# Altium schematic sheet SCH13_RS232.SchDoc: Beaglebone Black - RS232
size B; Organization: CWRUbotix; Address1: 10900 Euclid Avenue; Address2: Cleveland, OH 44106; Address3: USA; Revision: 1.0; SheetNumber: 13; SheetTotal: 13
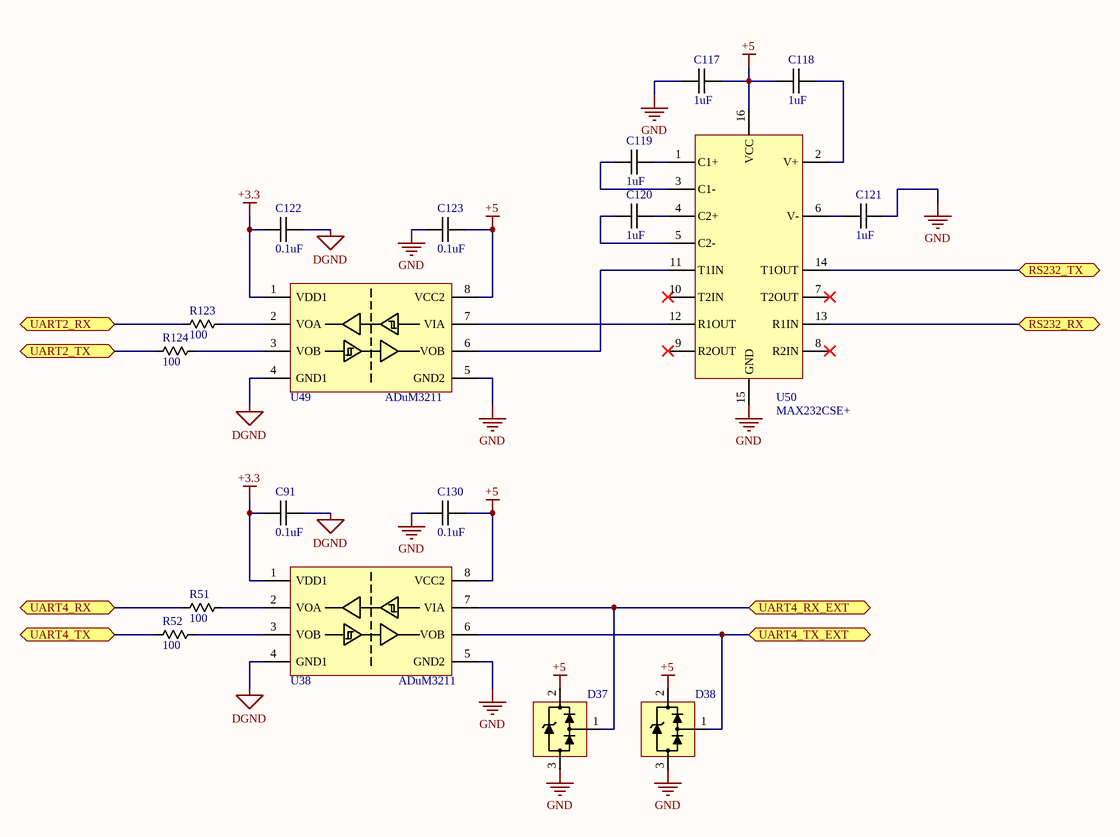
[diagram p0: SCH13_RS232.SchDoc]

## Parts
C91  0.1uF  [chip_0603]
C117  1uF  [chip_0805]
C118  1uF  [chip_0805]
C119  1uF  [chip_0805]
C120  1uF  [chip_0805]
C121  1uF  [chip_0805]
C122  0.1uF  [chip_0603]
C123  0.1uF  [chip_0603]
C130  0.1uF  [chip_0603]
D37  DLPT05  [sot-23-3]  (value not drawn)
D38  DLPT05  [sot-23-3]  (value not drawn)
R51  100  [chip_0603]
R52  100  [chip_0603]
R123  100  [chip_0603]
R124  100  [chip_0603]
U38  ADuM3211  [SO-8]
U49  ADuM3211  [SO-8]
U50  MAX232CSE+  [SO-16]

## Ports
RS232_RX (bidir), RS232_TX (bidir), UART2_RX (bidir), UART2_TX (bidir), UART4_RX (bidir), UART4_RX_EXT (bidir), UART4_TX (bidir), UART4_TX_EXT (bidir)

## Nets
+3.3: C91.2 C122.2 U38.1(VDD1) U49.1(VDD1)
+5: C117.2 C118.1 C123.1 C130.1 D37.2(VCC) D38.2(VCC) U38.8(VCC2) U49.8(VCC2) U50.16(VCC)
DGND: C91.1 C122.1 U38.4(GND1) U49.4(GND1)
GND: C117.1 C121.2 C123.2 C130.2 D37.3(GND) D38.3(GND) U38.5(GND2) U49.5(GND2) U50.15(GND)
RS232_RX: U50.13(R1IN) ; port RS232_RX
RS232_TX: U50.14(T1OUT) ; port RS232_TX
UART2_RX: R123.1 ; port UART2_RX
UART2_TX: R124.1 ; port UART2_TX
UART4_RX: R51.1 ; port UART4_RX
UART4_RX_EXT: D37.1(LINE) U38.7(VIA) ; port UART4_RX_EXT
UART4_TX: R52.1 ; port UART4_TX
UART4_TX_EXT: D38.1(LINE) U38.6(VOB) ; port UART4_TX_EXT
NetC118_2: C118.2 U50.2(V+)
NetC119_1: C119.1 U50.3(C1-)
NetC119_2: C119.2 U50.1(C1+)
NetC120_1: C120.1 U50.5(C2-)
NetC120_2: C120.2 U50.4(C2+)
NetC121_1: C121.1 U50.6(V-)
NetR51_2: R51.2 U38.2(VOA)
NetR52_2: R52.2 U38.3(VOB)
NetR123_2: R123.2 U49.2(VOA)
NetR124_2: R124.2 U49.3(VOB)
NetU49_6: U49.6(VOB) U50.11(T1IN)
NetU49_7: U49.7(VIA) U50.12(R1OUT)

Not connected (* = marked no-connect by the designer): U50 7(T2OUT)* 8(R2IN)* 9(R2OUT)* 10(T2IN)*

## Notes on the sheet
- Title
- Size:
- B
- Number:
- Revision:
- Date:
- Sheet
- of

## Library data of the parts
C91 C122 C123 C130 = CAP-00542: CAP, 0.1uF, ±10%, 16V, X7R, 0603; Manufacturer: Murata; Part Number: CAP-00542; Capacitance: 0.1uF; Tolerance: ±10%; Voltage Rating: 16V; Type: X7R
C117-C121 = CAP-00110: CAP, 1uF, 10%, 16V, X7R, 0805; Manufacturer: Murata; Manufacturer PN: GRM21BR71C105KA01K; Part Number: CAP-00110; Capacitance: 1uF; Tolerance: 10%; Voltage Rating: 16V; Type: X7R
D37 D38 = DIO-00057: TVS, Steering (Rail-Rail), 9.8V Clamping, 17A Peak Pulse, SOT-23; Manufacturer: Diodes Incorporated; Manufacturer PN: DLPT05-7-F; Reverse Breakdown Voltage: 6.0V; Part Number: DIO-00057; Type: TVS; Cost: 0.38
R51 R52 R123 R124 = RES-00178: RES SMD 100 OHM 1% 1/4W 0603; Manufacturer: Panasonic; Manufacturer PN: ERJ-PA3F1000V; Power Rating: 0.25W; Part Number: RES-00178; Resistance: 100; Tolerance: 1%
U38 U49 = IFACE-00015: Digital Isolator, Dual-Channel, ADuM3211; Manufacturer: Analog Devices; Manufacturer PN: ADuM3211ARZ; Part Number: IFACE-00015; Cost: 2.87
U50 = IFACE-00031: IC, RS-232 Transceiver, Dual Channel, SOIC-16; Manufacturer: Maxim Integrated; Part Number: IFACE-00031; Manufacturer PN: MAX232CSE+; Cost: 2.92